# EAGLE schematic Watch2 (EAGLE 7.6.0)
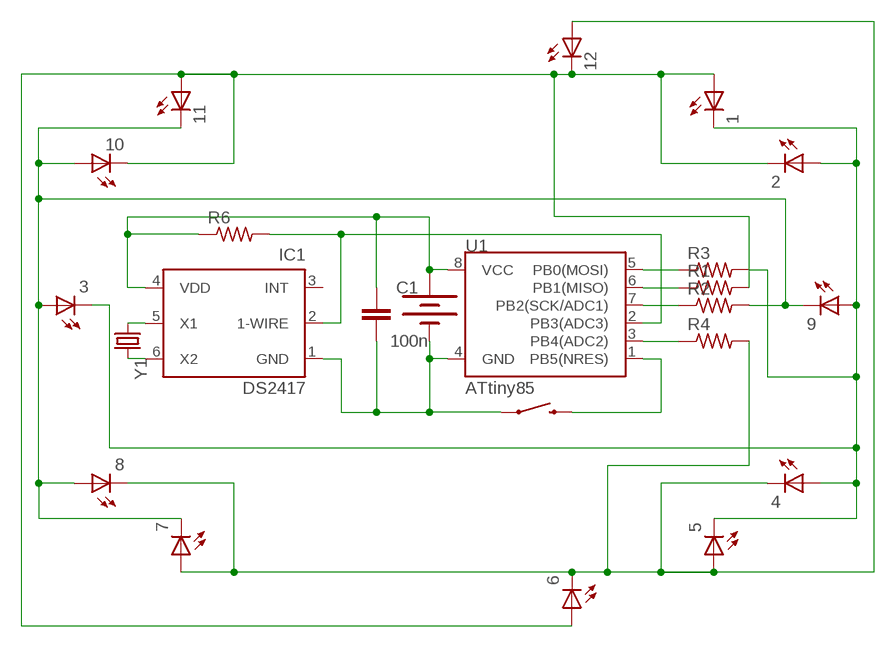
[diagram p0: schematic, sheet 1]

## Parts
1  LEDCHIPLED_0805  [CHIPLED_0805]
2  LEDCHIPLED_0805  [CHIPLED_0805]
3  LEDCHIPLED_0805  [CHIPLED_0805]
4  LEDCHIPLED_0805  [CHIPLED_0805]
5  LEDCHIPLED_0805  [CHIPLED_0805]
6  LEDCHIPLED_0805  [CHIPLED_0805]
7  LEDCHIPLED_0805  [CHIPLED_0805]
8  LEDCHIPLED_0805  [CHIPLED_0805]
9  LEDCHIPLED_0805  [CHIPLED_0805]
10  LEDCHIPLED_0805  [CHIPLED_0805]
11  LEDCHIPLED_0805  [CHIPLED_0805]
12  LEDCHIPLED_0805  [CHIPLED_0805]
BAT1  20mm coincell  BATTERY20MM_4LEGS  [BATTCON_20MM_4LEGS]
C1  100n  CAP0603-CAP  [0603-CAP]
IC1  DS2417  DS2417P  [TSOC6]
R1  R-US_M0805  [M0805]
R2  R-US_M0805  [M0805]
R3  R-US_M0805  [M0805]
R4  R-US_M0805  [M0805]
R6  R-US_M0805  [M0805]
S2  SWITCH-MOMENTARY-2SMD  [TACTILE-SWITCH-SMD]
U1  ATtiny85  ATTINY45TINY45-20-SMT  [SO08-EIAJ]
Y1  CRYSTAL32-SMD-MELF  [CRYSTAL-32KHZ-SMD-MELF]

## Nets
N$1: 1.C 2.A 3.C 4.A 5.C 9.A R3.2
N$2: 4.C 5.A 6.C 7.A 8.C 12.A R4.2
N$3: 3.A 7.C 8.A 9.C 10.A 11.C R2.2
N$4: 1.A 2.C 6.A 10.C 11.A 12.C R1.2
N$5: R3.1 U1.5(PB0(MOSI))
N$6: R1.1 U1.6(PB1(MISO))
N$7: R2.1 U1.7(PB2(SCK/ADC1))
N$8: R4.1 U1.3(PB4(ADC2))
N$9: BAT1.NEGATIVE(-) C1.2 IC1.1(GND) S2.1 U1.4(GND)
N$10: S2.3 U1.1(PB5(NRES))
N$11: IC1.2(1-WIRE) R6.2 U1.2(PB3(ADC3))
N$12: BAT1.POSITIVE@1(+) BAT1.POSITIVE@2(+) BAT1.POSITIVE@3(+) BAT1.POSITIVE@4(+) C1.1 IC1.4(VDD) R6.1 U1.8(VCC)
N$13: IC1.5(X1) Y1.X1
N$14: IC1.6(X2) Y1.X2

## Power pins joined to a net without a drawn wire
INT: IC1.3(INT)

## Library data of the parts
1-12 = adafruit:LED: LED OSRAM: - CHIPLED LG R971, LG N971, LY N971, LG Q971, LY Q971, LO R971, LY R971 LH N974, LH R974 LS Q976, LO Q976, LY Q976 LO Q996 - Hyper CHIPLED LW Q18S LB Q993, LB Q99A, LB R99A - SideLED LS A670, LO A670, LY A670, LG A670, LP A670 LB A673, LV A673, LT A673, LW A673 LH A674 LY A675 LS A676, LA A676, LO A676, LY A676, LW A676 LS A679, LY A679, LG A679 - Hyper Micro SIDELED® LS Y876, LA Y876, LO Y876, LY Y876 LT Y87S - SmartLED LW L88C, LW L88S LB L89C, LB L89S, LG L890 LS L89K, LO L89K, LY L89K LS L896, LA L896, LO L896, LY L896 - TOPLED LS T670, LO T670, LY T670, LG T670, LP T670 LSG T670, LSP T670, LSY T670, LOP T670, LYG T670 LG T671, LOG T671, LSG T671 LB T673, LV T673, LT T673, LW T673 LH T674 LS T676, LA T676, LO T676, LY T676, LB T676, LH T676, LSB T676, LW T676 LB T67C, LV T67C, LT T67C, LS T67K, LO T67K, LY T67K, LW E67C LS E67B, LA E67B, LO E67B, LY E67B, LB E67C, LV E67C, LT E67C LW T67C LS T679, LY T679, LG T679 LS T770, LO T770, LY T770, LG T770, LP T770 LB T773, LV T773, LT T773, LW T773 LH T774 LS E675, LA E675, LY E675, LS T675 LS T776, LA T776, LO T776, LY T776, LB T776 LHGB T686 LT T68C, LB T68C - Hyper Mini TOPLED® LB M676 - Mini TOPLED Santana® LG M470 LS M47K, LO M47K, LY M47K Source: http://www.osram.convergy.de/
BAT1 = SparkFun-Electromechanical:BATTERY: Battery Holders Various common sizes : AA, AAA, 18650 (PRT-12895), 20mm coin cell and 12mm coin cell. 20MM_4LEGS, BATT-10373; PROD_ID: BATT-10373
C1 = SparkFun-Capacitors:CAP: Capacitor Standard 0603 ceramic capacitor, and 0.1" leaded capacitor.
IC1 = maxim:DS2417: 1-Wire Digital Potentiometer DALLAS Semiconductor; http://www.maxim-ic.com/; OC_FARNELL: unknown; OC_NEWARK: unknown
R1-R4 R6 = adafruit:R-US_: RESISTOR, American symbol
S2 = SparkFun-Electromechanical:SWITCH-MOMENTARY-2: Various NO switches- pushbuttons, reed, etc; PROD_ID: SWCH-08247
U1 = SparkFun-DigitalIC:ATTINY45: Atmel 8-pin 2/4/8kB flash uC; PROD_ID: IC-08922; VALUE: Tiny45-20-SMT
Y1 = SparkFun-FreqCtrl:CRYSTAL: Various standard crystals. Proven footprints.; PROD_ID: XTAL-07894